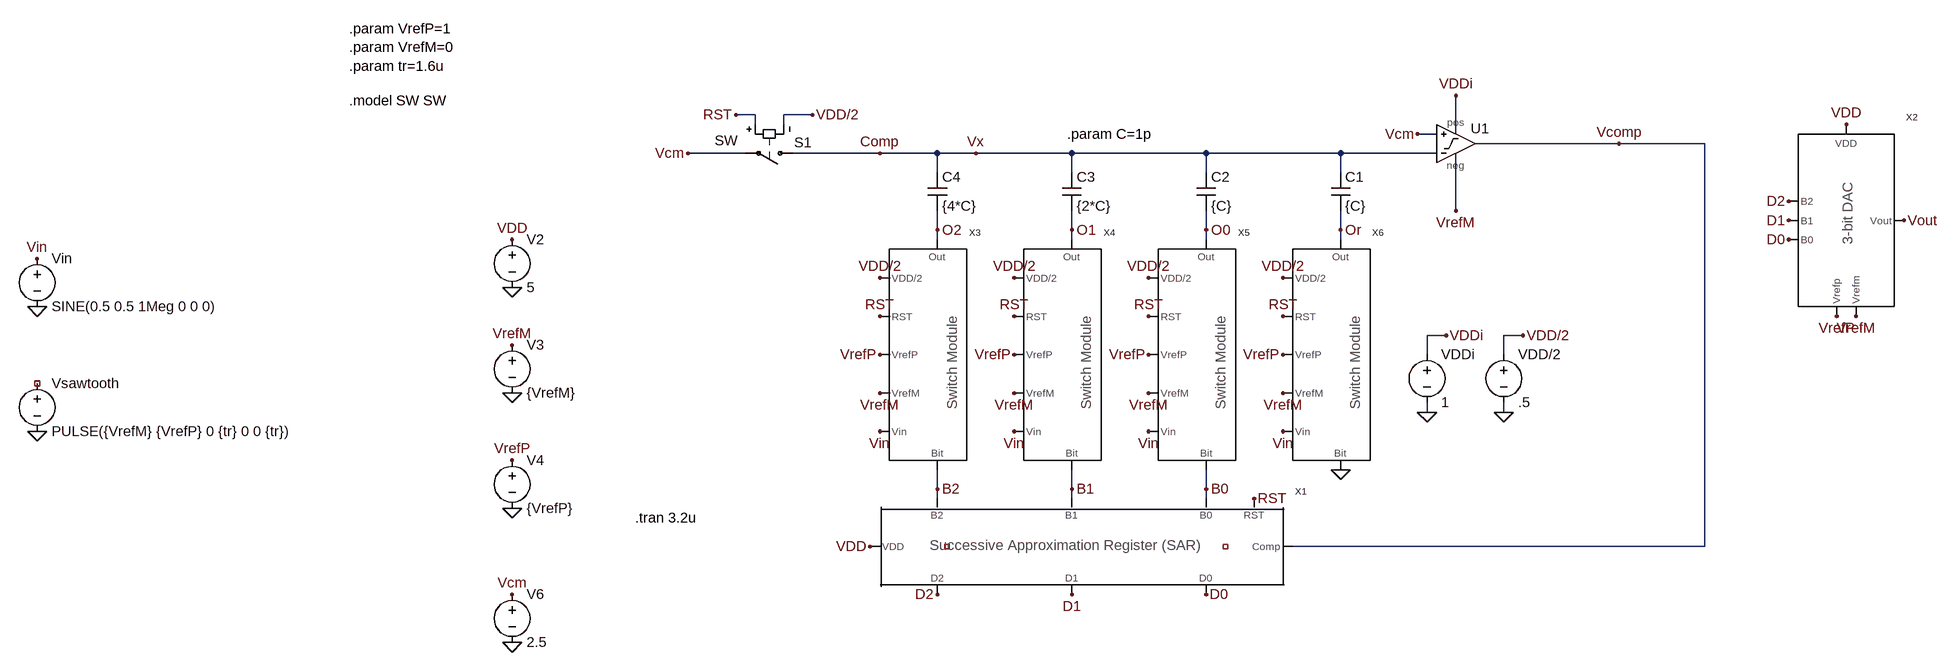
[diagram p0: schematic SAR_ADC_3Bit_full.asc]
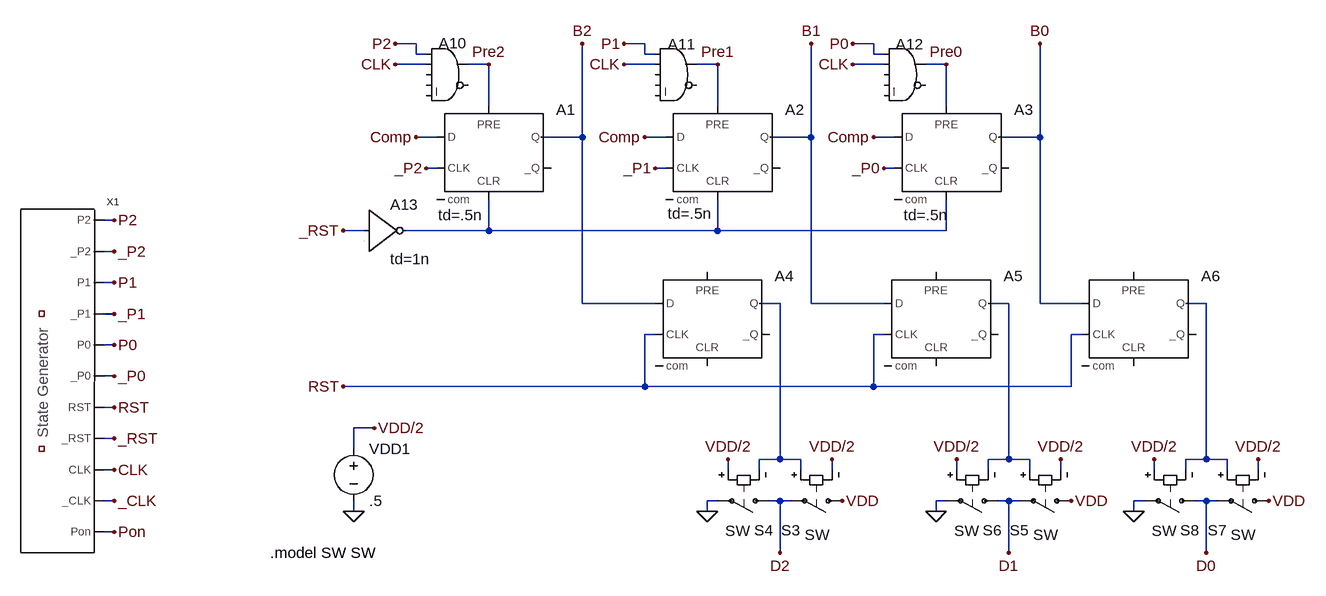
[diagram p1: sub-circuit successiveapproximationregister.asc]
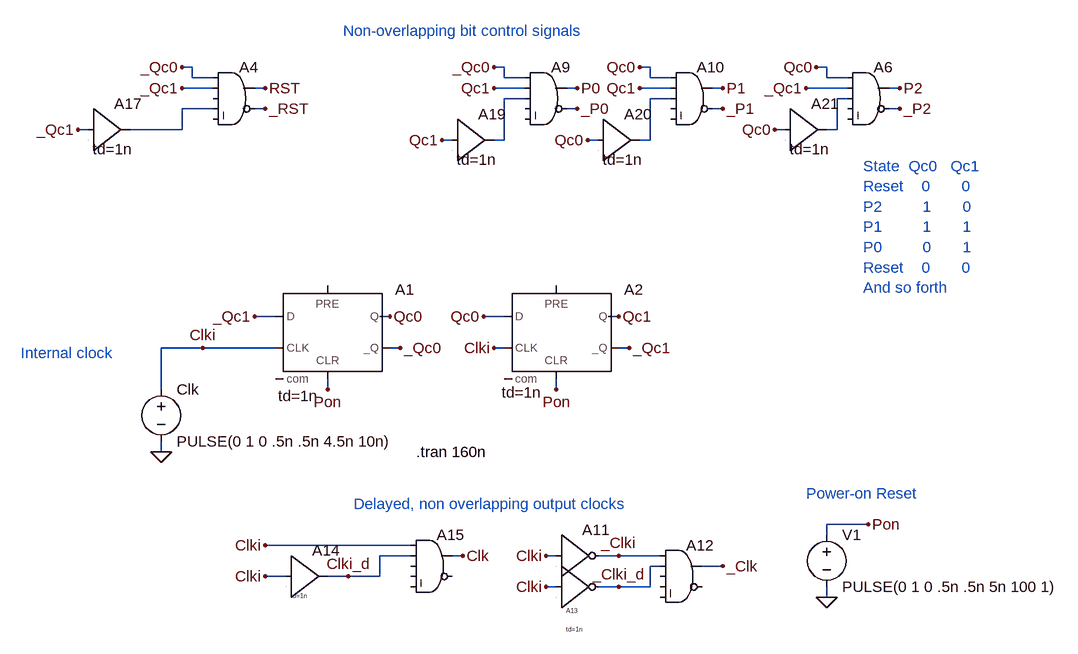
[diagram p2: sub-circuit stategen.asc]
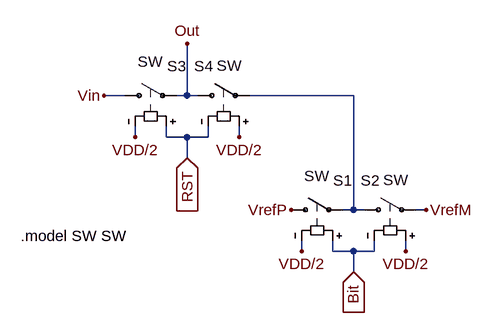
[diagram p3: sub-circuit switchmodule.asc]
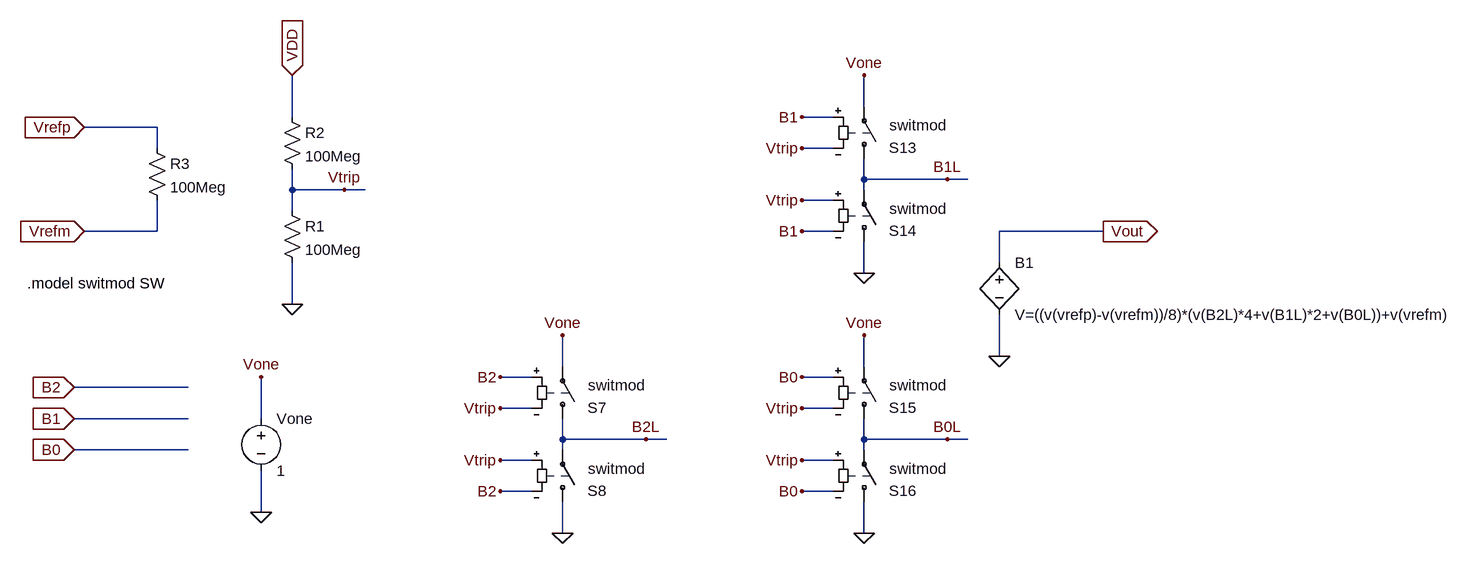
[diagram p4: sub-circuit ideal_3_bit_dac.asc]
SAR_ADC_3Bit_full.asc, the LTspice schematic file:
Version 4.1
SHEET 1 2136 768
WIRE -176 -544 -208 -544
WIRE -80 -544 -128 -544
WIRE -176 -528 -176 -544
WIRE -128 -528 -128 -544
WIRE 960 -512 928 -512
WIRE 992 -512 992 -576
WIRE 1264 -496 1024 -496
WIRE 1440 -496 1264 -496
WIRE -192 -480 -288 -480
WIRE 32 -480 -112 -480
WIRE 128 -480 32 -480
WIRE 192 -480 128 -480
WIRE 352 -480 192 -480
WIRE 576 -480 352 -480
WIRE 800 -480 576 -480
WIRE 960 -480 800 -480
WIRE 128 -448 128 -480
WIRE 352 -448 352 -480
WIRE 576 -448 576 -480
WIRE 800 -448 800 -480
WIRE 992 -384 992 -480
WIRE 128 -352 128 -384
WIRE 352 -352 352 -384
WIRE 576 -352 576 -384
WIRE 800 -352 800 -384
WIRE 128 -336 128 -352
WIRE 352 -336 352 -352
WIRE 576 -336 576 -352
WIRE 800 -336 800 -352
WIRE 976 -176 944 -176
WIRE 1104 -176 1072 -176
WIRE 944 -144 944 -176
WIRE 1072 -144 1072 -176
WIRE 944 -48 944 -64
WIRE 1072 -48 1072 -64
WIRE 128 80 128 48
WIRE 352 80 352 48
WIRE 576 80 576 48
WIRE 128 96 128 80
WIRE 352 96 352 80
WIRE 576 96 576 80
WIRE 1440 176 1440 -496
WIRE 1440 176 720 176
FLAG 656 96 RST
FLAG 32 -208 RST
FLAG 256 -208 RST
FLAG 480 -208 RST
FLAG 1072 -48 0
FLAG 32 -16 Vin
FLAG 256 -16 Vin
FLAG 480 -16 Vin
FLAG 1104 -176 VDD/2
FLAG 32 -272 VDD/2
FLAG 256 -272 VDD/2
FLAG 480 -272 VDD/2
FLAG 576 256 D0
FLAG 128 256 D2
FLAG 944 -48 0
FLAG 976 -176 VDDi
FLAG -208 -544 RST
FLAG 576 -352 O0
FLAG 352 -352 O1
FLAG 128 -352 O2
FLAG 576 80 B0
FLAG 352 80 B1
FLAG 128 80 B2
FLAG 32 -480 Comp
FLAG -80 -544 VDD/2
FLAG 192 -480 Vx
FLAG 992 -576 VDDi
FLAG 32 -80 VrefM
FLAG 256 -80 VrefM
FLAG 480 -80 VrefM
FLAG 928 -512 Vcm
FLAG 704 -208 RST
FLAG 704 -16 Vin
FLAG 704 -272 VDD/2
FLAG 704 -80 VrefM
FLAG 800 48 0
FLAG 800 -352 Or
FLAG 704 -144 VrefP
FLAG 480 -144 VrefP
FLAG 256 -144 VrefP
FLAG 32 -144 VrefP
FLAG -1584 -224 0
FLAG -784 -256 0
FLAG -784 -80 0
FLAG -784 112 0
FLAG -1584 -304 Vin
FLAG -784 -336 VDD
FLAG -784 -160 VrefM
FLAG -784 32 VrefP
FLAG -784 336 0
FLAG -784 256 Vcm
FLAG 16 176 VDD
FLAG 992 -384 VrefM
FLAG -288 -480 Vcm
FLAG 1264 -496 Vcomp
FLAG 352 256 D1
FLAG 2064 -368 Vout
FLAG 1872 -400 D2
FLAG 1872 -368 D1
FLAG 1872 -336 D0
FLAG 1952 -208 VrefP
FLAG 1984 -208 VrefM
FLAG 1968 -528 VDD
FLAG -1584 -16 0
SYMBOL SuccessiveApproximationRegister -128 208 R0
SYMATTR InstName X1
SYMBOL SwitchModule 48 32 R0
SYMATTR InstName X3
SYMBOL SwitchModule 272 32 R0
SYMATTR InstName X4
SYMBOL SwitchModule 496 32 R0
SYMATTR InstName X5
SYMBOL voltage 1072 -160 R0
WINDOW 123 0 0 Left 0
WINDOW 39 0 0 Left 0
SYMATTR InstName VDD/2
SYMATTR Value .5
SYMBOL cap 784 -448 R0
SYMATTR InstName C1
SYMATTR Value {C}
SYMBOL cap 560 -448 R0
SYMATTR InstName C2
SYMATTR Value {C}
SYMBOL cap 336 -448 R0
SYMATTR InstName C3
SYMATTR Value {2*C}
SYMBOL cap 112 -448 R0
SYMATTR InstName C4
SYMATTR Value {4*C}
SYMBOL voltage 944 -160 R0
WINDOW 123 0 0 Left 0
WINDOW 39 0 0 Left 0
SYMATTR InstName VDDi
SYMATTR Value 1
SYMBOL sw -96 -480 R90
WINDOW 0 -18 -15 VRight 2
WINDOW 3 -21 109 VRight 2
SYMATTR InstName S1
SYMBOL SwitchModule 720 32 R0
SYMATTR InstName X6
SYMBOL voltage -1584 -320 R0
WINDOW 123 0 0 Left 0
WINDOW 39 0 0 Left 0
SYMATTR InstName Vin
SYMATTR Value SINE(0.5 0.5 1Meg 0 0 0)
SYMBOL voltage -784 -352 R0
SYMATTR InstName V2
SYMATTR Value 5
SYMBOL voltage -784 -176 R0
SYMATTR InstName V3
SYMATTR Value {VrefM}
SYMBOL voltage -784 16 R0
SYMATTR InstName V4
SYMATTR Value {VrefP}
SYMBOL voltage -784 240 R0
SYMATTR InstName V6
SYMATTR Value 2.5
SYMBOL MyComparator 992 -496 R0
SYMATTR InstName U1
SYMBOL Ideal_3_bit_DAC 1888 -224 R0
SYMATTR InstName X2
SYMBOL voltage -1584 -112 R0
SYMATTR InstName Vsawtooth
SYMATTR Value PULSE({VrefM} {VrefP} 0 {tr} 0 0 {tr})
TEXT 344 -512 Left 2 !.param C=1p
TEXT -1056 -568 Left 2 !.model SW SW
TEXT -1056 -688 Left 2 !.param VrefP=1\n.param VrefM=0\n.param tr=1.6u
TEXT -376 128 Left 2 !.tran 3.2u

successiveapproximationregister.asc, the sub-circuit schematic file:
Version 4
SHEET 1 1744 1132
WIRE 352 32 320 32
WIRE 704 32 672 32
WIRE 1056 32 1024 32
WIRE 352 48 352 32
WIRE 368 48 352 48
WIRE 704 48 704 32
WIRE 720 48 704 48
WIRE 1056 48 1056 32
WIRE 1072 48 1056 48
WIRE 368 64 320 64
WIRE 464 64 432 64
WIRE 720 64 672 64
WIRE 816 64 784 64
WIRE 1072 64 1024 64
WIRE 1168 64 1136 64
WIRE 464 128 464 64
WIRE 816 128 816 64
WIRE 1168 128 1168 64
WIRE 384 176 352 176
WIRE 608 176 608 32
WIRE 608 176 544 176
WIRE 736 176 704 176
WIRE 960 176 960 32
WIRE 960 176 896 176
WIRE 1088 176 1056 176
WIRE 1312 176 1312 32
WIRE 1312 176 1248 176
WIRE 384 224 368 224
WIRE 736 224 720 224
WIRE 1088 224 1072 224
WIRE -112 304 -128 304
WIRE 272 320 240 320
WIRE 464 320 464 272
WIRE 464 320 336 320
WIRE 816 320 816 272
WIRE 816 320 464 320
WIRE 1168 320 1168 272
WIRE 1168 320 816 320
WIRE -112 352 -128 352
WIRE -112 400 -128 400
WIRE 608 432 608 176
WIRE 720 432 608 432
WIRE 912 432 880 432
WIRE 960 432 960 176
WIRE 1072 432 960 432
WIRE 1264 432 1232 432
WIRE 1312 432 1312 176
WIRE 1376 432 1312 432
WIRE 1568 432 1536 432
WIRE -112 448 -128 448
WIRE 720 480 704 480
WIRE 1072 480 1056 480
WIRE 1376 480 1360 480
WIRE -112 496 -128 496
WIRE -112 544 -128 544
WIRE 704 560 704 480
WIRE 704 560 240 560
WIRE 1056 560 1056 480
WIRE 1056 560 704 560
WIRE 1360 560 1360 480
WIRE 1360 560 1056 560
WIRE -112 592 -128 592
WIRE 288 624 256 624
WIRE -112 640 -128 640
WIRE 256 656 256 624
WIRE 912 672 912 432
WIRE 912 672 880 672
WIRE 944 672 912 672
WIRE 1264 672 1264 432
WIRE 1264 672 1232 672
WIRE 1296 672 1264 672
WIRE 1568 672 1568 432
WIRE 1568 672 1536 672
WIRE 1600 672 1568 672
WIRE -112 688 -128 688
WIRE 832 688 832 672
WIRE 880 688 880 672
WIRE 944 688 944 672
WIRE 992 688 992 672
WIRE 1184 688 1184 672
WIRE 1232 688 1232 672
WIRE 1296 688 1296 672
WIRE 1344 688 1344 672
WIRE 1488 688 1488 672
WIRE 1536 688 1536 672
WIRE 1600 688 1600 672
WIRE 1648 688 1648 672
WIRE -112 736 -128 736
WIRE 816 736 800 736
WIRE 912 736 896 736
WIRE 928 736 912 736
WIRE 1168 736 1152 736
WIRE 1264 736 1248 736
WIRE 1280 736 1264 736
WIRE 1472 736 1456 736
WIRE 1568 736 1552 736
WIRE 1584 736 1568 736
WIRE 256 752 256 736
WIRE 800 752 800 736
WIRE 1152 752 1152 736
WIRE 1456 752 1456 736
WIRE -112 784 -128 784
WIRE 912 816 912 736
WIRE 1264 816 1264 736
WIRE 1568 816 1568 736
FLAG -112 304 P2
FLAG -112 400 P1
FLAG -112 496 P0
FLAG -112 352 _P2
FLAG -112 448 _P1
FLAG -112 544 _P0
FLAG -112 592 RST
FLAG -112 640 _RST
FLAG -112 688 CLK
FLAG -112 736 _CLK
FLAG -112 784 Pon
FLAG 1024 32 P0
FLAG 672 32 P1
FLAG 320 32 P2
FLAG 240 560 RST
FLAG 240 320 _RST
FLAG 352 176 Comp
FLAG 704 176 Comp
FLAG 1056 176 Comp
FLAG 320 64 CLK
FLAG 672 64 CLK
FLAG 1024 64 CLK
FLAG 1072 224 _P0
FLAG 720 224 _P1
FLAG 368 224 _P2
FLAG 1312 32 B0
FLAG 960 32 B1
FLAG 608 32 B2
FLAG 1568 816 D0
FLAG 1264 816 D1
FLAG 912 816 D2
FLAG 1168 64 Pre0
FLAG 816 64 Pre1
FLAG 464 64 Pre2
FLAG 800 752 0
FLAG 1008 736 VDD
FLAG 992 672 VDD/2
FLAG 832 672 VDD/2
FLAG 1152 752 0
FLAG 1360 736 VDD
FLAG 1344 672 VDD/2
FLAG 1184 672 VDD/2
FLAG 1456 752 0
FLAG 1664 736 VDD
FLAG 1648 672 VDD/2
FLAG 1488 672 VDD/2
FLAG 256 752 0
FLAG 288 624 VDD/2
SYMBOL Digital\\dflop 464 128 R0
WINDOW 3 -78 168 Left 2
SYMATTR Value td=.5n
SYMATTR InstName A1
SYMBOL Digital\\dflop 816 128 R0
WINDOW 3 -77 166 Left 2
SYMATTR Value td=.5n
SYMATTR InstName A2
SYMBOL Digital\\dflop 800 384 R0
SYMATTR InstName A4
SYMBOL Digital\\dflop 1152 384 R0
SYMATTR InstName A5
SYMBOL Digital\\dflop 1456 384 R0
SYMATTR InstName A6
SYMBOL StateGen -256 672 R0
SYMATTR InstName X1
SYMBOL Digital\\and 400 16 R0
WINDOW 0 -13 15 Left 2
SYMATTR InstName A10
SYMBOL Digital\\and 752 16 R0
WINDOW 0 -13 17 Left 2
SYMATTR InstName A11
SYMBOL Digital\\and 1104 16 R0
WINDOW 0 -14 17 Left 2
SYMATTR InstName A12
SYMBOL Digital\\inv 272 256 R0
SYMATTR InstName A13
SYMATTR Value td=1n
SYMBOL sw 1024 736 R90
WINDOW 0 45 81 VRight 2
WINDOW 3 52 36 VRight 2
SYMATTR InstName S3
SYMBOL sw 912 736 R90
WINDOW 0 45 40 VLeft 2
WINDOW 3 46 84 VLeft 2
SYMATTR InstName S4
SYMBOL sw 1376 736 R90
WINDOW 0 45 81 VRight 2
WINDOW 3 52 36 VRight 2
SYMATTR InstName S5
SYMBOL sw 1264 736 R90
WINDOW 0 45 40 VLeft 2
WINDOW 3 46 84 VLeft 2
SYMATTR InstName S6
SYMBOL sw 1680 736 R90
WINDOW 0 45 81 VRight 2
WINDOW 3 52 36 VRight 2
SYMATTR InstName S7
SYMBOL sw 1568 736 R90
WINDOW 0 45 40 VLeft 2
WINDOW 3 46 84 VLeft 2
SYMATTR InstName S8
SYMBOL voltage 256 640 R0
WINDOW 123 0 0 Left 0
WINDOW 39 0 0 Left 0
SYMATTR InstName VDD1
SYMATTR Value .5
SYMBOL Digital\\dflop 1168 128 R0
WINDOW 3 -66 168 Left 2
SYMATTR Value td=.5n
SYMATTR InstName A3
TEXT 128 816 Left 2 !.model SW SW

stategen.asc, the sub-circuit schematic file:
Version 4
SHEET 1 880 716
WIRE -768 -272 -784 -272
WIRE -288 -272 -304 -272
WIRE -64 -272 -80 -272
WIRE 208 -272 192 -272
WIRE -768 -256 -768 -272
WIRE -736 -256 -768 -256
WIRE -288 -256 -288 -272
WIRE -256 -256 -288 -256
WIRE -64 -256 -64 -272
WIRE -32 -256 -64 -256
WIRE 208 -256 208 -272
WIRE 240 -256 208 -256
WIRE -736 -240 -784 -240
WIRE -656 -240 -672 -240
WIRE -256 -240 -304 -240
WIRE -176 -240 -192 -240
WIRE -32 -240 -80 -240
WIRE 48 -240 32 -240
WIRE 240 -240 176 -240
WIRE 320 -240 304 -240
WIRE -256 -224 -288 -224
WIRE -32 -224 -64 -224
WIRE 240 -224 224 -224
WIRE -736 -208 -784 -208
WIRE -656 -208 -672 -208
WIRE -176 -208 -192 -208
WIRE 48 -208 32 -208
WIRE 320 -208 304 -208
WIRE -928 -176 -944 -176
WIRE -784 -176 -784 -208
WIRE -784 -176 -864 -176
WIRE 144 -176 128 -176
WIRE 224 -176 224 -224
WIRE 224 -176 208 -176
WIRE -368 -160 -384 -160
WIRE -288 -160 -288 -224
WIRE -288 -160 -304 -160
WIRE -144 -160 -160 -160
WIRE -64 -160 -64 -224
WIRE -64 -160 -80 -160
WIRE -640 112 -672 112
WIRE -464 112 -480 112
WIRE -288 112 -320 112
WIRE -112 112 -128 112
WIRE -752 160 -816 160
WIRE -640 160 -752 160
WIRE -448 160 -464 160
WIRE -288 160 -304 160
WIRE -96 160 -112 160
WIRE -816 224 -816 160
WIRE -560 224 -560 208
WIRE -208 224 -208 208
WIRE -816 320 -816 304
WIRE 272 432 208 432
WIRE 208 448 208 432
WIRE -432 464 -656 464
WIRE -432 480 -480 480
WIRE -352 480 -368 480
WIRE -208 480 -224 480
WIRE -112 480 -144 480
WIRE -48 480 -112 480
WIRE -48 496 -64 496
WIRE 48 496 16 496
WIRE -624 512 -656 512
WIRE -528 512 -560 512
WIRE -480 512 -480 480
WIRE -480 512 -528 512
WIRE -208 528 -224 528
WIRE -112 528 -144 528
WIRE -64 528 -64 496
WIRE -64 528 -112 528
WIRE 208 544 208 528
FLAG -816 320 0
FLAG -448 160 _Qc0
FLAG -96 160 _Qc1
FLAG -464 112 Qc0
FLAG -112 112 Qc1
FLAG -752 160 Clki
FLAG 272 432 Pon
FLAG 208 544 0
FLAG -560 224 Pon
FLAG -208 224 Pon
FLAG 320 -240 P2
FLAG 48 -240 P1
FLAG -176 -240 P0
FLAG -784 -272 _Qc0
FLAG -784 -240 _Qc1
FLAG -304 -272 _Qc0
FLAG -304 -240 Qc1
FLAG -80 -240 Qc1
FLAG -80 -272 Qc0
FLAG 48 496 _Clk
FLAG -352 480 Clk
FLAG -656 512 Clki
FLAG -224 480 Clki
FLAG -224 528 Clki
FLAG -656 464 Clki
FLAG 320 -208 _P2
FLAG 48 -208 _P1
FLAG -176 -208 _P0
FLAG -528 512 Clki_d
FLAG -112 480 _Clki
FLAG -304 160 Clki
FLAG 192 -272 Qc0
FLAG -656 -240 RST
FLAG -656 -208 _RST
FLAG -944 -176 _Qc1
FLAG -384 -160 Qc1
FLAG -160 -160 Qc0
FLAG 128 -176 Qc0
FLAG -112 528 _Clki_d
FLAG 176 -240 _Qc1
FLAG -320 112 Qc0
FLAG -672 112 _Qc1
SYMBOL Digital\\dflop -560 64 R0
WINDOW 3 -76 170 Left 2
SYMATTR Value td=1n
SYMATTR InstName A1
SYMBOL Digital\\dflop -208 64 R0
WINDOW 3 -84 165 Left 2
SYMATTR Value td=1n
SYMATTR InstName A2
SYMBOL voltage -816 208 R0
WINDOW 123 0 0 Left 0
WINDOW 39 0 0 Left 0
SYMATTR InstName Clk
SYMATTR Value PULSE(0 1 0 .5n .5n 4.5n 10n)
SYMBOL voltage 208 432 R0
WINDOW 123 0 0 Left 0
WINDOW 39 0 0 Left 0
SYMATTR InstName V1
SYMATTR Value PULSE(0 1 0 .5n .5n 5n 100 1)
SYMBOL Digital\\and -704 -288 R0
SYMATTR InstName A4
SYMBOL Digital\\and -224 -288 R0
SYMATTR InstName A9
SYMBOL Digital\\and 0 -288 R0
SYMATTR InstName A10
SYMBOL Digital\\inv -208 416 R0
SYMATTR InstName A11
SYMBOL Digital\\and -16 448 R0
SYMATTR InstName A12
SYMBOL Digital\\inv -208 464 R0
WINDOW 0 15 101 Left 0
WINDOW 3 15 129 Left 0
SYMATTR InstName A13
SYMATTR Value td=1n
SYMBOL Digital\\buf1 -624 448 R0
WINDOW 3 7 94 Left 0
SYMATTR Value td=1n
SYMATTR InstName A14
SYMBOL Digital\\and -400 432 R0
SYMATTR InstName A15
SYMBOL Digital\\and 272 -288 R0
SYMATTR InstName A6
SYMBOL Digital\\buf1 -928 -240 R0
WINDOW 3 7 94 Left 2
SYMATTR Value td=1n
SYMATTR InstName A17
SYMBOL Digital\\buf1 -368 -224 R0
WINDOW 3 7 94 Left 2
SYMATTR Value td=1n
SYMATTR InstName A19
SYMBOL Digital\\buf1 -144 -224 R0
WINDOW 3 7 94 Left 2
SYMATTR Value td=1n
SYMATTR InstName A20
SYMBOL Digital\\buf1 144 -240 R0
WINDOW 3 7 94 Left 2
SYMATTR Value td=1n
SYMATTR InstName A21
TEXT -424 320 Left 2 !.tran 160n
TEXT -520 400 Left 2 ;Delayed, non overlapping output clocks
TEXT -1032 168 Left 2 ;Internal clock
TEXT -536 -328 Left 2 ;Non-overlapping bit control signals
TEXT 176 384 Left 2 ;Power-on Reset
TEXT 264 -120 Left 2 ;State  Qc0   Qc1\nReset    0       0  \nP2         1       0      \nP1         1       1      \nP0         0       1     \nReset    0       0     \nAnd so forth

switchmodule.asc, the sub-circuit schematic file:
Version 4
SHEET 1 880 680
WIRE -176 -32 -208 -32
WIRE -80 -32 -80 -112
WIRE -80 -32 -96 -32
WIRE -64 -32 -80 -32
WIRE 176 -32 16 -32
WIRE -160 32 -160 16
WIRE -112 32 -112 16
WIRE -80 32 -112 32
WIRE -48 32 -48 16
WIRE -48 32 -80 32
WIRE 0 32 0 16
WIRE -80 64 -80 32
WIRE 176 144 176 -32
WIRE 176 144 160 144
WIRE 192 144 176 144
WIRE 288 144 272 144
WIRE 96 208 96 192
WIRE 144 208 144 192
WIRE 176 208 144 208
WIRE 208 208 208 192
WIRE 208 208 176 208
WIRE 256 208 256 192
WIRE 176 240 176 208
FLAG 176 240 Bit
IOPIN 176 240 In
FLAG 80 144 VrefP
FLAG 96 208 VDD/2
FLAG 256 208 VDD/2
FLAG -80 64 RST
IOPIN -80 64 In
FLAG -160 32 VDD/2
FLAG 0 32 VDD/2
FLAG -208 -32 Vin
FLAG -80 -112 Out
FLAG 288 144 VrefM
SYMBOL sw 64 144 R270
WINDOW 0 45 81 VRight 2
WINDOW 3 52 36 VRight 2
SYMATTR InstName S1
SYMBOL sw 176 144 R270
WINDOW 0 45 40 VLeft 2
WINDOW 3 46 84 VLeft 2
SYMATTR InstName S2
SYMBOL sw -192 -32 R270
WINDOW 0 45 81 VRight 2
WINDOW 3 52 36 VRight 2
SYMATTR InstName S3
SYMBOL sw -80 -32 R270
WINDOW 0 45 40 VLeft 2
WINDOW 3 46 84 VLeft 2
SYMATTR InstName S4
TEXT -336 184 Left 2 !.model SW SW

ideal_3_bit_dac.asc, the sub-circuit schematic file:
Version 4
SHEET 1 2732 1316
WIRE 1408 -208 1408 -256
WIRE 528 -192 528 -256
WIRE 1360 -192 1312 -192
WIRE 320 -176 208 -176
WIRE 320 -144 320 -176
WIRE 1360 -144 1312 -144
WIRE 1408 -96 1408 -128
WIRE 1536 -96 1408 -96
WIRE 1568 -96 1536 -96
WIRE 528 -80 528 -112
WIRE 608 -80 528 -80
WIRE 640 -80 608 -80
WIRE 1408 -80 1408 -96
WIRE 1360 -64 1312 -64
WIRE 528 -48 528 -80
WIRE 320 -16 320 -64
WIRE 320 -16 208 -16
WIRE 1360 -16 1312 -16
WIRE 1776 -16 1616 -16
WIRE 1616 32 1616 -16
WIRE 1408 48 1408 0
WIRE 528 96 528 32
WIRE 1616 176 1616 112
WIRE 944 192 944 144
WIRE 1408 192 1408 144
WIRE 896 208 848 208
WIRE 1360 208 1312 208
WIRE 368 224 192 224
WIRE 896 256 848 256
WIRE 1360 256 1312 256
WIRE 368 272 192 272
WIRE 480 272 480 208
WIRE 944 304 944 272
WIRE 1072 304 944 304
WIRE 1104 304 1072 304
WIRE 1408 304 1408 272
WIRE 1536 304 1408 304
WIRE 1568 304 1536 304
WIRE 368 320 192 320
WIRE 944 320 944 304
WIRE 1408 320 1408 304
WIRE 896 336 848 336
WIRE 1360 336 1312 336
WIRE 896 384 848 384
WIRE 1360 384 1312 384
WIRE 480 416 480 352
WIRE 944 448 944 400
WIRE 1408 448 1408 400
FLAG 608 -80 Vtrip
FLAG 528 -256 VDD
IOPIN 528 -256 In
FLAG 848 208 B2
FLAG 848 256 Vtrip
FLAG 848 336 Vtrip
FLAG 848 384 B2
FLAG 1072 304 B2L
FLAG 944 448 0
FLAG 1312 -192 B1
FLAG 1312 -144 Vtrip
FLAG 1312 -64 Vtrip
FLAG 1312 -16 B1
FLAG 1536 -96 B1L
FLAG 1408 48 0
FLAG 1312 208 B0
FLAG 1312 256 Vtrip
FLAG 1312 336 Vtrip
FLAG 1312 384 B0
FLAG 1536 304 B0L
FLAG 1408 448 0
FLAG 1616 176 0
FLAG 1776 -16 Vout
IOPIN 1776 -16 Out
FLAG 208 -176 Vrefp
IOPIN 208 -176 In
FLAG 208 -16 Vrefm
IOPIN 208 -16 In
FLAG 192 224 B2
IOPIN 192 224 In
FLAG 192 272 B1
IOPIN 192 272 In
FLAG 192 320 B0
IOPIN 192 320 In
FLAG 528 96 0
FLAG 480 416 0
FLAG 480 208 Vone
FLAG 944 144 Vone
FLAG 1408 -256 Vone
FLAG 1408 144 Vone
SYMBOL res 512 -64 R0
SYMATTR InstName R1
SYMATTR Value 100Meg
SYMBOL res 512 -208 R0
SYMATTR InstName R2
SYMATTR Value 100Meg
SYMBOL sw 944 288 M180
WINDOW 3 24 -12 Left 0
WINDOW 38 39 67 Left 2
WINDOW 0 38 33 Left 2
SYMATTR Value ""
SYMATTR SpiceModel switmod
SYMATTR InstName S7
SYMBOL sw 944 416 M180
WINDOW 3 24 -12 Left 0
WINDOW 38 39 67 Left 2
WINDOW 0 38 33 Left 2
SYMATTR Value ""
SYMATTR SpiceModel switmod
SYMATTR InstName S8
SYMBOL sw 1408 -112 M180
WINDOW 3 24 -12 Left 0
WINDOW 38 39 67 Left 2
WINDOW 0 38 33 Left 2
SYMATTR Value ""
SYMATTR SpiceModel switmod
SYMATTR InstName S13
SYMBOL sw 1408 16 M180
WINDOW 3 24 -12 Left 0
WINDOW 38 39 67 Left 2
WINDOW 0 38 33 Left 2
SYMATTR Value ""
SYMATTR SpiceModel switmod
SYMATTR InstName S14
SYMBOL sw 1408 288 M180
WINDOW 3 24 -12 Left 0
WINDOW 38 39 67 Left 2
WINDOW 0 38 33 Left 2
SYMATTR Value ""
SYMATTR SpiceModel switmod
SYMATTR InstName S15
SYMBOL sw 1408 416 M180
WINDOW 3 24 -12 Left 0
WINDOW 38 39 67 Left 2
WINDOW 0 38 33 Left 2
SYMATTR Value ""
SYMATTR SpiceModel switmod
SYMATTR InstName S16
SYMBOL bv 1616 16 R0
WINDOW 123 24 132 Left 0
SYMATTR InstName B1
SYMATTR Value V=((v(vrefp)-v(vrefm))/8)*(v(B2L)*4+v(B1L)*2+v(B0L))+v(vrefm)
SYMBOL res 304 -160 R0
SYMATTR InstName R3
SYMATTR Value 100Meg
SYMBOL voltage 480 256 R0
WINDOW 123 0 0 Left 0
WINDOW 39 0 0 Left 0
SYMATTR InstName Vone
SYMATTR Value 1
TEXT 120 64 Left 2 !.model switmod SW

The netlist it stands for:
* SAR_ADC_3Bit_full.asc
X§X1 Vcomp B0 B1 B2 NC_01 RST D0 D1 D2 NC_02 VDD successiveapproximationregister
X§X3 Vin B2 VrefM VDD/2 O2 RST VrefP switchmodule
X§X4 Vin B1 VrefM VDD/2 O1 RST VrefP switchmodule
X§X5 Vin B0 VrefM VDD/2 O0 RST VrefP switchmodule
VDD/2 VDD/2 0 .5
C1 Vx Or {C}
C2 Vx O0 {C}
C3 Vx O1 {2*C}
C4 Vx O2 {4*C}
VDDi VDDi 0 1
S1 Vx Vcm RST VDD/2 SW
X§X6 Vin 0 VrefM VDD/2 Or RST VrefP switchmodule
Vin Vin 0 SINE(0.5 0.5 1Meg 0 0 0)
V2 VDD 0 5
V3 VrefM 0 {VrefM}
V4 VrefP 0 {VrefP}
V6 Vcm 0 2.5
X§U1 Vcm Vx VDDi VrefM Vcomp MyComparator  ; pins in+ in- pos neg out
X§X2 D2 D1 D0 Vout VrefP VrefM VDD ideal_3_bit_dac
Vsawtooth NC_03 0 PULSE({VrefM} {VrefP} 0 {tr} 0 0 {tr})

* block symbol definitions
.subckt successiveapproximationregister Comp B0 B1 B2 B3 RST D0 D1 D2 D3 VDD
A1 Comp 0 _P2 Pre2 N001 0 B2 0 DFLOP td=.5n
A2 Comp 0 _P1 Pre1 N001 0 B1 0 DFLOP td=.5n
A4 B2 0 RST 0 0 0 N002 0 DFLOP
A5 B1 0 RST 0 0 0 N003 0 DFLOP
A6 B0 0 RST 0 0 0 N004 0 DFLOP
XX1 RST P0 P1 P2 NC_01 CLK _CLK _RST _P0 _P1 _P2 NC_02 Pon stategen
A10 P2 CLK 0 0 0 0 Pre2 0 AND
A11 P1 CLK 0 0 0 0 Pre1 0 AND
A12 P0 CLK 0 0 0 0 Pre0 0 AND
A13 _RST 0 0 0 0 N001 0 0 BUF td=1n
S3 VDD D2 N002 VDD/2 SW
S4 D2 0 VDD/2 N002 SW
S5 VDD D1 N003 VDD/2 SW
S6 D1 0 VDD/2 N003 SW
S7 VDD D0 N004 VDD/2 SW
S8 D0 0 VDD/2 N004 SW
VDD1 VDD/2 0 .5
A3 Comp 0 _P0 Pre0 N001 0 B0 0 DFLOP td=.5n
.model SW SW
.ends successiveapproximationregister

.subckt stategen RST P0 P1 P2 P3 CLK _CLK _RST _P0 _P1 _P2 _P3 Pon
A1 _Qc1 0 Clki 0 Pon _Qc0 Qc0 0 DFLOP td=1n
A2 Qc0 0 Clki 0 Pon _Qc1 Qc1 0 DFLOP td=1n
V§Clk Clki 0 PULSE(0 1 0 .5n .5n 4.5n 10n)
V1 Pon 0 PULSE(0 1 0 .5n .5n 5n 100 1)
A4 _Qc0 _Qc1 0 N004 0 _RST RST 0 AND
A9 _Qc0 Qc1 N001 0 0 _P0 P0 0 AND
A10 Qc0 Qc1 N002 0 0 _P1 P1 0 AND
A11 Clki 0 0 0 0 _Clki 0 0 BUF
A12 _Clki _Clki_d 0 0 0 0 _Clk 0 AND
A13 Clki 0 0 0 0 _Clki_d 0 0 BUF td=1n
A14 Clki 0 0 0 0 0 Clki_d 0 BUF td=1n
A15 Clki Clki_d 0 0 0 0 Clk 0 AND
A6 Qc0 _Qc1 N003 0 0 _P2 P2 0 AND
A17 _Qc1 0 0 0 0 0 N004 0 BUF td=1n
A19 Qc1 0 0 0 0 0 N001 0 BUF td=1n
A20 Qc0 0 0 0 0 0 N002 0 BUF td=1n
A21 Qc0 0 0 0 0 0 N003 0 BUF td=1n
.tran 160n
* Delayed, non overlapping output clocks
* Internal clock
* Non-overlapping bit control signals
* Power-on Reset
* State  Qc0   Qc1
* Reset    0       0
* P2         1       0
* P1         1       1
* P0         0       1
* Reset    0       0
* And so forth
.ends stategen

.subckt switchmodule Vin Bit VrefM VDD/2 Out RST VrefP
S1 VrefP N001 Bit VDD/2 SW
S2 N001 VrefM VDD/2 Bit SW
S3 Vin Out RST VDD/2 SW
S4 Out N001 VDD/2 RST SW
.model SW SW
.ends switchmodule

.subckt ideal_3_bit_dac B2 B1 B0 Vout Vrefp Vrefm VDD
R1 Vtrip 0 100Meg
R2 VDD Vtrip 100Meg
S7 B2L Vone B2 Vtrip switmod
S8 0 B2L Vtrip B2 switmod
S13 B1L Vone B1 Vtrip switmod
S14 0 B1L Vtrip B1 switmod
S15 B0L Vone B0 Vtrip switmod
S16 0 B0L Vtrip B0 switmod
B1 Vout 0 V=((v(vrefp)-v(vrefm))/8)*(v(B2L)*4+v(B1L)*2+v(B0L))+v(vrefm)
R3 Vrefp Vrefm 100Meg
Vone Vone 0 1
.model switmod SW
.ends ideal_3_bit_dac

.param C=1p
.model SW SW
.param VrefP=1
.param VrefM=0
.param tr=1.6u
.tran 3.2u
.lib MyComparator.sub
.backanno
.end